# Altium schematic sheet Current Scaler.SchDoc
size Letter; DocumentNumber: 7; SheetNumber: 7; SheetTotal: 7
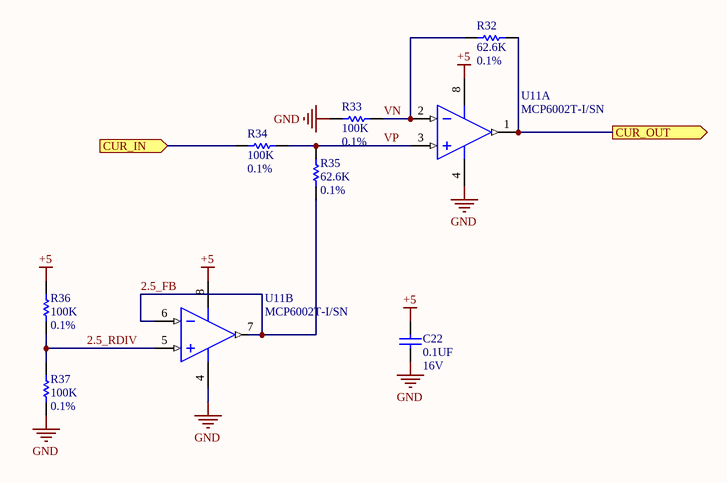
[diagram p0: Current Scaler.SchDoc]

## Parts
C22  Val: 0.1UF  Vol: 16V  [0603_CAP]  (hidden comment: CAP 0603 0.1UF 16V 10% X7R)
R32  Val: 62.6K  Tol: 0.1%  [0603_RES]  (hidden comment: RES 0603 62.6K 0.1%)
R33  Val: 100K  Tol: 0.1%  [0603_RES]  (hidden comment: RES 0603 100K 0.1%)
R34  Val: 100K  Tol: 0.1%  [0603_RES]  (hidden comment: RES 0603 100K 0.1%)
R35  Val: 62.6K  Tol: 0.1%  [0603_RES]  (hidden comment: RES 0603 62.6K 0.1%)
R36  Val: 100K  Tol: 0.1%  [0603_RES]  (hidden comment: RES 0603 100K 0.1%)
R37  Val: 100K  Tol: 0.1%  [0603_RES]  (hidden comment: RES 0603 100K 0.1%)
U11  MCP6002T-I/SN  [SOIC-SN8_L]  (parts A,B of 2)

## Ports
CUR_IN (in), CUR_OUT (out)

## Nets
+5: C22.2 R36.2 U11.8(VDD)
GND: C22.1 R33.1 R37.1 U11.4(VSS)
2.5_FB: R35.1 U11.6(VINB-) U11.7(VOUTB)
2.5_RDIV: R36.1 R37.2 U11.5(VINB+)
CUR_IN: R34.1 ; port CUR_IN
CUR_OUT: R32.1 U11.1(VOUTA) ; port CUR_OUT
VN: R32.2 R33.2 U11.2(VINA-)
VP: R34.2 R35.2 U11.3(VINA+)

## Notes on the sheet
- Title
- Size:
- Date:
- Letter
- Number:
- Time:
- Revision:
- Sheet
- of
- File:

## Library data of the parts
C22 = CAP 0603 0.1UF 16V 10% X7R: Capacitor Surface Mount 0603 Footprint 0.1UF 16V 10% Tolerance Ceramic X7R; Manufacturer: Various; PCB Package: 0603; Description in Visual: Cap SMT 0603 0.1UF 16V 10%  Cer X7R; P/N: CAP 0603 0.1UF 16V 10% X7R; Manufacturer P/N: Various; Value: 0.1UF; Voltage: 16V; Tolerance: 10%; Type: Ceramic X7R; ComponentLink1Description: Manufacturer Website; ComponentLink2Description: Component Datasheet; ComponentLink3Description: Octopart Link
R32 R35 = RES 0603 62.6K 0.1%: Resistor Surface Mount, 51K Ohms, 0603 Footprint, 0.05% Tolerance 0.1W; Manufacturer: Various; PCB Package: 0603; Description in Visual: Res SMT 62.6K 0603  0.05%  0.1W; P/N: RES 0603 62.6K 0.1%; Manufacturer P/N: Various; Value: 62.6K; Power_Rating: 0.1W; Tolerance: 0.1%
R33 R34 R36 R37 = RES 0603 100K 0.1%: Resistor Surface Mount, 100K Ohms, 0603 Footprint, 0.1% Tolerance 0.1W; Manufacturer: Various; PCB Package: 0603; Description in Visual: Res SMT 100K 0603  0.1%  0.1W; P/N: RES 0603 100K 0.1%; Manufacturer P/N: Various; Value: 100K; Power_Rating: 0.1W; Tolerance: 0.1%
U11 = CMP-0187-00288-2: 1 MHz, Low-Power Operational Amplifier, 8-Pin SOIC, Industrial Temperature, Tape and Reel; ComponentLink2Description: Datasheet; Code_JEDEC: MS-012; ComponentLink1Description: Manufacturer URL; PackageDescription: 8-Lead Plastic Small Outline (SN) - Narrow, 3.90mm Body [SOIC]; PackageVersion: revBB, Aug-2009; DatasheetVersion: revJ, Nov-2009; Code_IPC: SOIC127P600-8; ComponentLink3URL: http://www.microchip.com/stellent/groups/techpub_sg/documents/packagingspec/en012702.pdf; ComponentLink3Description: Package Specification; PackageReference: SOIC-SN8; ComponentLink2URL: http://ww1.microchip.com/downloads/en/DeviceDoc/21733j.pdf; RevisionNote: URLs added.; ComponentLink1URL: http://www.microchip.com/